# Altium project Reader-Rev6.PrjPcb
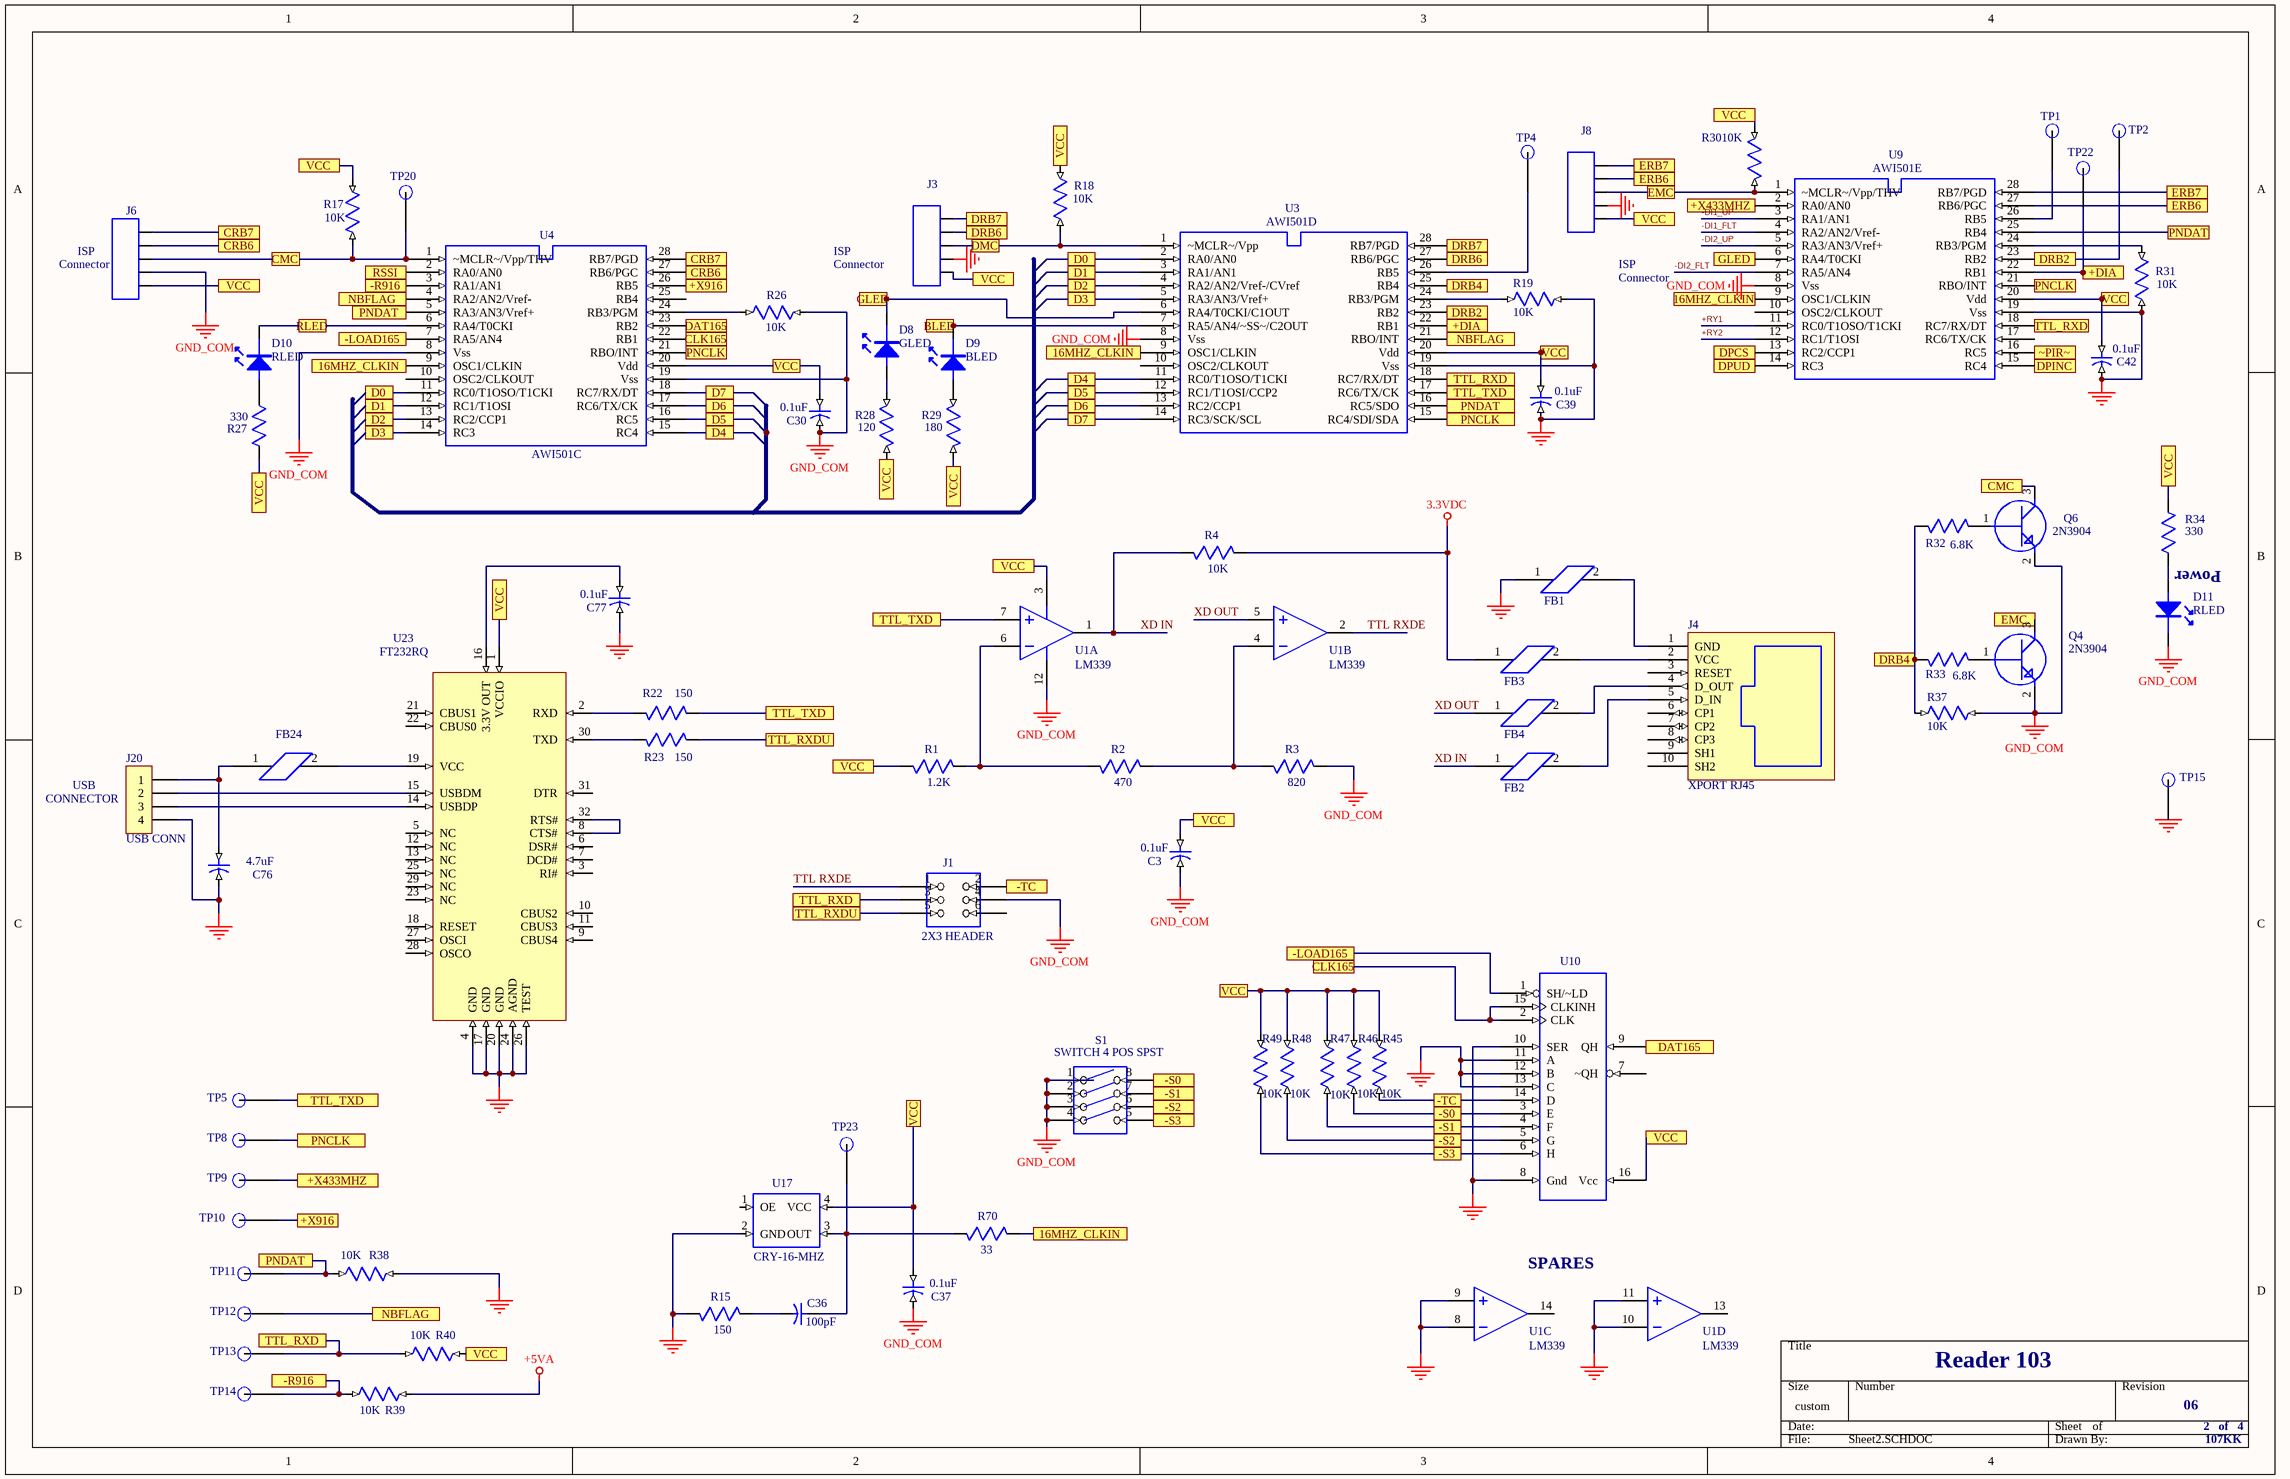
[diagram p0: Sheet2.SCHDOC]
3 sheets, 201 parts. Net scope: global (net labels, ports and power ports of the same name join across sheets).
Sheets:
  Sheet2.SCHDOC
  Sheet3.SCHDOC
  Sheet4.SCHDOC

## Sheet Sheet2.SCHDOC
size 431 x 279 mm; SheetNumber: 0; SheetTotal: 0

### Parts
C3  0.1uF  [0603]
C30  0.1uF  [0603]
C36  100pF  [0603]
C37  0.1uF  [0603]
C39  0.1uF  [0603]
C42  0.1uF  [0603]
C76  4.7uF  [0805]
C77  0.1uF  [0603]
D8  GLED  [LED TH]
D9  BLED  [LED TH]
D10  RLED  [LED TH]
D11  RLED  [LED TH]
FB1  FB  [0603]  (value not drawn)
FB2  FB  [0603]  (value not drawn)
FB3  FB  [0603]  (value not drawn)
FB4  FB  [0603]  (value not drawn)
FB24  FB  [0603]  (value not drawn)
J1  2X3 HEADER  [HDR3X2]
J3  HDR5  [HDR5]  (value not drawn)
J4  XPORT RJ45  [CONN XPORT]
J6  HDR5  [HDR5]  (value not drawn)
J8  1X5 HEADER  [HDR5]  (value not drawn)
J20  USB CONN  [USB JACK]
Q4  2N3904  [SOT-23]
Q6  2N3904  [SOT-23]
R1  1.2K  [0603]
R2  470  [0603]
R3  820  [0603]
R4  10K  [0603]
R15  150  [0603]
R17  10K  [0603]
R18  10K  [0603]
R19  10K  [0603]
R22  150  [0603]
R23  150  [0603]
R26  10K  [0603]
R27  330  [0603]
R28  120  [0603]
R29  180  [0603]
R30  10K  [0603]
R31  10K  [0603]
R32  6.8K  [0603]
R33  6.8K  [0603]
R34  330  [0603]
R37  10K  [0603]
R38  10K  [0603]
R39  10K  [0603]
R40  10K  [0603]
R45  10K  [0603]
R46  10K  [0603]
R47  10K  [0603]
R48  10K  [0603]
R49  10K  [0603]
R70  33  [0603]
S1  SWITCH 4 POS SPST  [SWITCH 4 POS SPST]
TP1  TP  [TEST POINT PAD 3]  (value not drawn)
TP2  TP  [TEST POINT PAD 3]  (value not drawn)
TP4  TP  [TEST POINT PAD 3]  (value not drawn)
TP5  TP  [TEST POINT PAD 3]  (value not drawn)
TP8  TP  [TEST POINT PAD 3]  (value not drawn)
TP9  TP  [TEST POINT PAD 3]  (value not drawn)
TP10  TP  [TEST POINT PAD 3]  (value not drawn)
TP11  TP  [TEST POINT PAD 3]  (value not drawn)
TP12  TP  [TEST POINT PAD 3]  (value not drawn)
TP13  TP  [TEST POINT PAD 3]  (value not drawn)
TP14  TP  [TEST POINT PAD 3]  (value not drawn)
TP15  TP  [TEST POINT PAD 3]  (value not drawn)
TP20  TP  [TEST POINT PAD 3]  (value not drawn)
TP22  TP  [TEST POINT PAD 3]  (value not drawn)
TP23  TP  [TEST POINT PAD 3]  (value not drawn)
U1  LM339  [SO14]  (parts A,B,C,D of 4)
U3  AWI501D  [SSOP-28]
U4  AWI501C  [PIC16F870]
U9  AWI501E  [PIC16F870]
U10  74165  [SO16]  (value not drawn)
U17  CRY-16-MHZ  [CRY-SMD-5-7]
U23  FT232RQ  [QFN32]

### Ports
16MHZ_CLKIN, +DIA, +X433MHZ, +X916, -LOAD165, -R916, -S0, -S1, -S2, -S3, -TC, BLED, CLK165, CMC, CRB6, CRB7, D0, D1, D2, D3, D4, D5, D6, D7, DAT165, DMC, DPCS, DPINC, DPUD, DRB2, DRB4, DRB6, DRB7, EMC, ERB6, ERB7, GLED, NBFLAG, PNCLK, PNDAT, RLED, RSSI, TTL_RXD, TTL_RXDU, TTL_TXD, VCC, ~PIR~

### Nets
3.3VDC: FB3.1 R4.1(A)
+5VA: R39.1(A)
+5VD: C3.1(A) C30.1(A) C37.1(A) C39.1(A) C42.1(A) J3.5 J6.5 J8.5 R1.2(B) R17.1(A) R18.1(A) R27.1(A) R28.1(A) R29.1(A) R30.1(A) R34.2(B) R40.1(A) R45.2(B) R46.2(B) R47.2(B) R48.2(B) R49.2(B) U1.3 U3.20(Vdd) U4.20(Vdd) U9.20(Vdd) U10.16(Vcc) U17.4(VCC) U23.1(VCCIO) ; port VCC
GND_COM: C3.2(B) C30.2(B) C37.2(B) C39.2(B) C42.2(B) C76.2(B) C77.2(B) D11.K FB1.1 J1.4 J3.4 J6.4 J8.4 J20.4 Q4.2 Q6.2 R3.1(A) R15.2(B) R19.1(A) R26.2(B) R31.2(B) R37.2(B) R38.1(A) S1.1 S1.2 S1.3 S1.4 TP15.1(TP) U1.8 U1.9 U1.10 U1.11 U1.12 U3.8(Vss) U3.19(Vss) U4.8(Vss) U4.19(Vss) U9.8(Vss) U9.19(Vss) U10.8(Gnd) U10.10(SER) U10.11(A) U10.12(B) U10.13(C) U17.2(GND) U23.4(GND) U23.17(GND) U23.20(GND) U23.24(AGND) U23.26(TEST)
+RY1: U9.11(RC0/T1OSO/T1CKI)
+RY2: U9.12(RC1/T1OSI)
-DI1_FLT: U9.4(RA2/AN2/Vref-)
-DI1_UP: U9.3(RA1/AN1)
-DI2_FLT: U9.7(RA5/AN4)
-DI2_UP: U9.5(RA3/AN3/Vref+)
SOUT: R39.2(B) TP14.1(TP) U4.3(RA1/AN1) ; port -R916
TTL RXDE: J1.1 U1.2
XD IN: FB2.1 R4.2(B) U1.1
XD OUT: FB4.1 U1.5
NetC36_1: C36.1(A) R70.2(B) TP23.1(TP) U17.3(OUT)
NetC36_2: C36.2(B) R15.1(A)
NetC40_1: U9.13(RC2/CCP1) ; port DPCS
NetC43_1: TP9.1(TP) U9.2(RA0/AN0) ; port +X433MHZ
NetC45_1: TP10.1(TP) U4.26(RB5) ; port +X916
NetC47_1: U4.2(RA0/AN0) ; port RSSI
NetC50_1: U9.14(RC3) ; port DPUD
NetC51_1: U9.15(RC4) ; port DPINC
NetC76_1: C76.1(A) FB24.1 J20.1
NetC77_1: C77.1(A) U23.16(3.3V_OUT)
NetD3_A: U9.16(RC5) ; port ~PIR~
NetD8_A: D8.A R28.2(B)
NetD8_K: D8.K U3.6(RA4/T0CKI/C1OUT) U9.6(RA4/T0CKI) ; port GLED
NetD9_A: D9.A R29.2(B)
NetD9_K: D9.K U3.7(RA5/AN4/~SS~/C2OUT) ; port BLED
NetD10_A: D10.A R27.2(B)
NetD10_K: D10.K U4.6(RA4/T0CKI) ; port RLED
NetD11_A: D11.A R34.1(A)
NetFB1_2: FB1.2 J4.1(GND)
NetFB2_2: FB2.2 J4.5(D_IN)
NetFB3_2: FB3.2 J4.2(VCC)
NetFB4_2: FB4.2 J4.4(D_OUT)
NetFB24_2: FB24.2 U23.19(VCC)
NetJ1_2: J1.2 R45.1(A) U10.14(D) ; port -TC
NetJ1_3: J1.3 R40.2(B) TP13.1(TP) U3.18(RC7/RX/DT) U9.18(RC7/RX/DT) ; port TTL_RXD
NetJ1_5: J1.5 R23.1(A) ; port TTL_RXDU
NetJ3_1: J3.1 U3.28(RB7/PGD) ; port DRB7
NetJ3_2: J3.2 U3.27(RB6/PGC) ; port DRB6
NetJ3_3: J3.3 R18.2(B) U3.1(~MCLR~/Vpp) ; port DMC
NetJ6_1: J6.1 U4.28(RB7/PGD) ; port CRB7
NetJ6_2: J6.2 U4.27(RB6/PGC) ; port CRB6
NetJ6_3: J6.3 Q6.3 R17.2(B) TP20.1(TP) U4.1(~MCLR~/Vpp/THV) ; port CMC
NetJ8_1: J8.1 U9.28(RB7/PGD) ; port ERB7
NetJ8_2: J8.2 U9.27(RB6/PGC) ; port ERB6
NetJ8_3: J8.3 Q4.3 R30.2(B) U9.1(~MCLR~/Vpp/THV) ; port EMC
NetJ19_1: R70.1(A) U3.9(OSC1/CLKIN) U4.9(OSC1/CLKIN) U9.9(OSC1/CLKIN) ; port 16MHZ_CLKIN
NetJ20_2: J20.2 U23.15(USBDM)
NetJ20_3: J20.3 U23.14(USBDP)
NetQ4_1: Q4.1 R33.2(B)
NetQ6_1: Q6.1 R32.2(B)
NetR1_1: R1.1(A) R2.2(B) U1.6
NetR2_1: R2.1(A) R3.2(B) U1.4
NetR19_2: R19.2(B) U3.24(RB3/PGM)
NetR22_1: R22.1(A) TP5.1(TP) U1.7 U3.17(RC6/TX/CK) ; port TTL_TXD
NetR22_2: R22.2(B) U23.2(RXD)
NetR23_2: R23.2(B) U23.30(TXD)
NetR26_1: R26.1(A) U4.24(RB3/PGM)
NetR31_1: R31.1(A) U9.24(RB3/PGM)
NetR32_1: R32.1(A) R33.1(A) R37.1(A) U3.25(RB4) ; port DRB4
NetR38_2: R38.2(B) TP11.1(TP) U3.16(RC5/SDO) U4.5(RA3/AN3/Vref+) U9.25(RB4) ; port PNDAT
NetR46_1: R46.1(A) S1.8 U10.3(E) ; port -S0
NetR47_1: R47.1(A) S1.7 U10.4(F) ; port -S1
NetR48_1: R48.1(A) S1.6 U10.5(G) ; port -S2
NetR49_1: R49.1(A) S1.5 U10.6(H) ; port -S3
NetTP1_1: TP1.1(TP) U9.26(RB5)
NetTP2_1: TP2.1(TP) U3.23(RB2) U9.23(RB2) ; port DRB2
NetTP4_1: TP4.1(TP) U3.26(RB5)
NetTP8_1: TP8.1(TP) U3.15(RC4/SDI/SDA) U4.21(RBO/INT) U9.21(RBO/INT) ; port PNCLK
NetTP12_1: TP12.1(TP) U3.21(RBO/INT) U4.4(RA2/AN2/Vref-) ; port NBFLAG
NetTP22_1: TP22.1(TP) U3.22(RB1) U9.22(RB1) ; port +DIA
NetU3_2: U3.2(RA0/AN0) U4.11(RC0/T1OSO/T1CKI) ; port D0
NetU3_3: U3.3(RA1/AN1) U4.12(RC1/T1OSI) ; port D1
NetU3_4: U3.4(RA2/AN2/Vref-/CVref) U4.13(RC2/CCP1) ; port D2
NetU3_5: U3.5(RA3/AN3/Vref+) U4.14(RC3) ; port D3
NetU3_11: U3.11(RC0/T1OSO/T1CKI) U4.15(RC4) ; port D4
NetU3_12: U3.12(RC1/T1OSI/CCP2) U4.16(RC5) ; port D5
NetU3_13: U3.13(RC2/CCP1) U4.17(RC6/TX/CK) ; port D6
NetU3_14: U3.14(RC3/SCK/SCL) U4.18(RC7/RX/DT) ; port D7
NetU4_7: U4.7(RA5/AN4) U10.1(SH/~LD) ; port -LOAD165
NetU4_22: U4.22(RB1) U10.2(CLK) U10.15(CLKINH) ; port CLK165
NetU4_23: U4.23(RB2) U10.9(QH) ; port DAT165
NetU23_8: U23.8(CTS#) U23.32(RTS#)

Not connected (* = marked no-connect by the designer): J1 6; J4 3(RESET) 6(CP1) 7(CP2) 8(CP3) 9(SH1) 10(SH2); U1 13 14; U3 10(OSC2/CLKOUT); U4 10(OSC2/CLKOUT) 25(RB4); U9 10(OSC2/CLKOUT) 17(RC6/TX/CK); U10 7(~QH); U17 1(OE); U23 3(RI#) 5(NC) 6(DSR#) 7(DCD#) 9(CBUS4) 10(CBUS2) 11(CBUS3) 12(NC) 13(NC) 18(RESET) 21(CBUS1) 22(CBUS0) 23(NC) 25(NC) 27(OSCI) 28(OSCO) 29(NC) 31(DTR)

### Notes on the sheet
- (near J6) Connector
- (near J6) ISP
- ISP
- Connector
- Power
- (near J20) CONNECTOR
- USB
- (near U1) SPARES
- Reader 103
- 06
- 2   of   4
- 107KK

### Library data of the parts
C3 C30 C37 C39 C42 C76 C77 = C_603: Part Field 1: Part Number ECJ-1VF1H104Z; Part Field 2: Vendor Panasonic - ECG; Part Field 3: Description CAP .1UF 50V CERAMIC Y5V 0603
C36 = C_0603: Part Field 1: Part Number ECJ-1VC1H101J; Part Field 2: Vendor Panasonic - ECG; Part Field 3: Description CAP CERAMIC 100PF 50V 0603 SMD
D8-D11 = LED
FB1-FB4 FB24 = FB_0603: Part Field 1: Part Number EXC-ML16A270U; Part Field 2: Vendor Panasonic - ECG; Part Field 3: Description BEAD CORE 27 OHM 4A 0603 SMD
J1 = HDR3X2: Part Field 1: Part Number PTC03DAAN
J4 = XPORT
J8 = HDR5
J20 = CON4: Connector
Q4 Q6 = XSTR_NPN_SOT23: Part Field 1: Part Number FMMT3904TA; Part Field 2: Vendor Zetex Inc.; Part Field 3: Description TRANS GP NPN 40V 200MA SOT-23
R1-R4 R15 R22 R23 R70 = R_0603: Part Field 1: Part Number 9C06031A1500JLHFT; Part Field 2: Vendor Yageo America; Part Field 3: Description RES 150 OHM 1/16W 5% 0603 SMD
R17-R19 R26 R30 R31 R37-R40 = R_603: Part Field 1: Part Number ERA-V15J103V; Part Field 2: Vendor Panasonic - ECG; Part Field 3: Description RES 10K OHM 1/16W 1500PPM 5%0603
R27 = R_0603: Part Field 1: Part Number ERJ-3GEYJ331V; Part Field 2: Vendor Panasonic - ECG; Part Field 3: Description RES 330 OHM 1/10W 5% 0603 SMD
R28 = R0402: Part Field 1: Part Number ERJ-3GEYJ121V; Part Field 2: Vendor Panasonic - ECG; Part Field 3: Description RES 120 OHM 1/10W 5% 0603 SMD
R29 = R0402: Part Field 1: Part Number ERJ-3GEYJ181V; Part Field 2: Vendor Panasonic - ECG; Part Field 3: Description RES 180 OHM 1/10W 5% 0603 SMD
R32-R34 = R_0603: Part Field 1: Part Number ERJ-3GEYJ682V; Part Field 2: Vendor Panasonic - ECG; Part Field 3: Description RES 6.8K OHM 1/10W 5% 0603 SMD
R45-R49 = R_603: Part Field 1: Part Number ERJ-3GEYJ121V; Part Field 2: Vendor Panasonic - ECG; Part Field 3: Description RES 120 OHM 1/10W 5% 0603 SMD
S1 = SW_4PIN_SMT
TP1 TP2 TP4 TP5 TP8-TP15 TP20 TP22 TP23 = TESTPOINT_1
U1 = OPAMP: Operational Amplifier
U3 = PIC16F876A: Part Field 1: Part Number PIC16F876A-E/SO; Part Field 2: Vendor Microchip Technology; Part Field 3: Description IC MCU FLASH 8KX14 W/AD 28-SOIC
U4 U9 = PIC16F870: Part Field 1: Part Number PIC16F870-E/SO; Part Field 2: Vendor Microchip Technology; Part Field 3: Description IC MCU CMOS 20MHZ 2K FLSH 28SOIC
U10 = 74165-SO-16
U17 = CRY-SMD-5-7
U23 = USB FT232RQ

## Sheet Sheet3.SCHDOC
size 431 x 279 mm; SheetNumber: 0; SheetTotal: 0
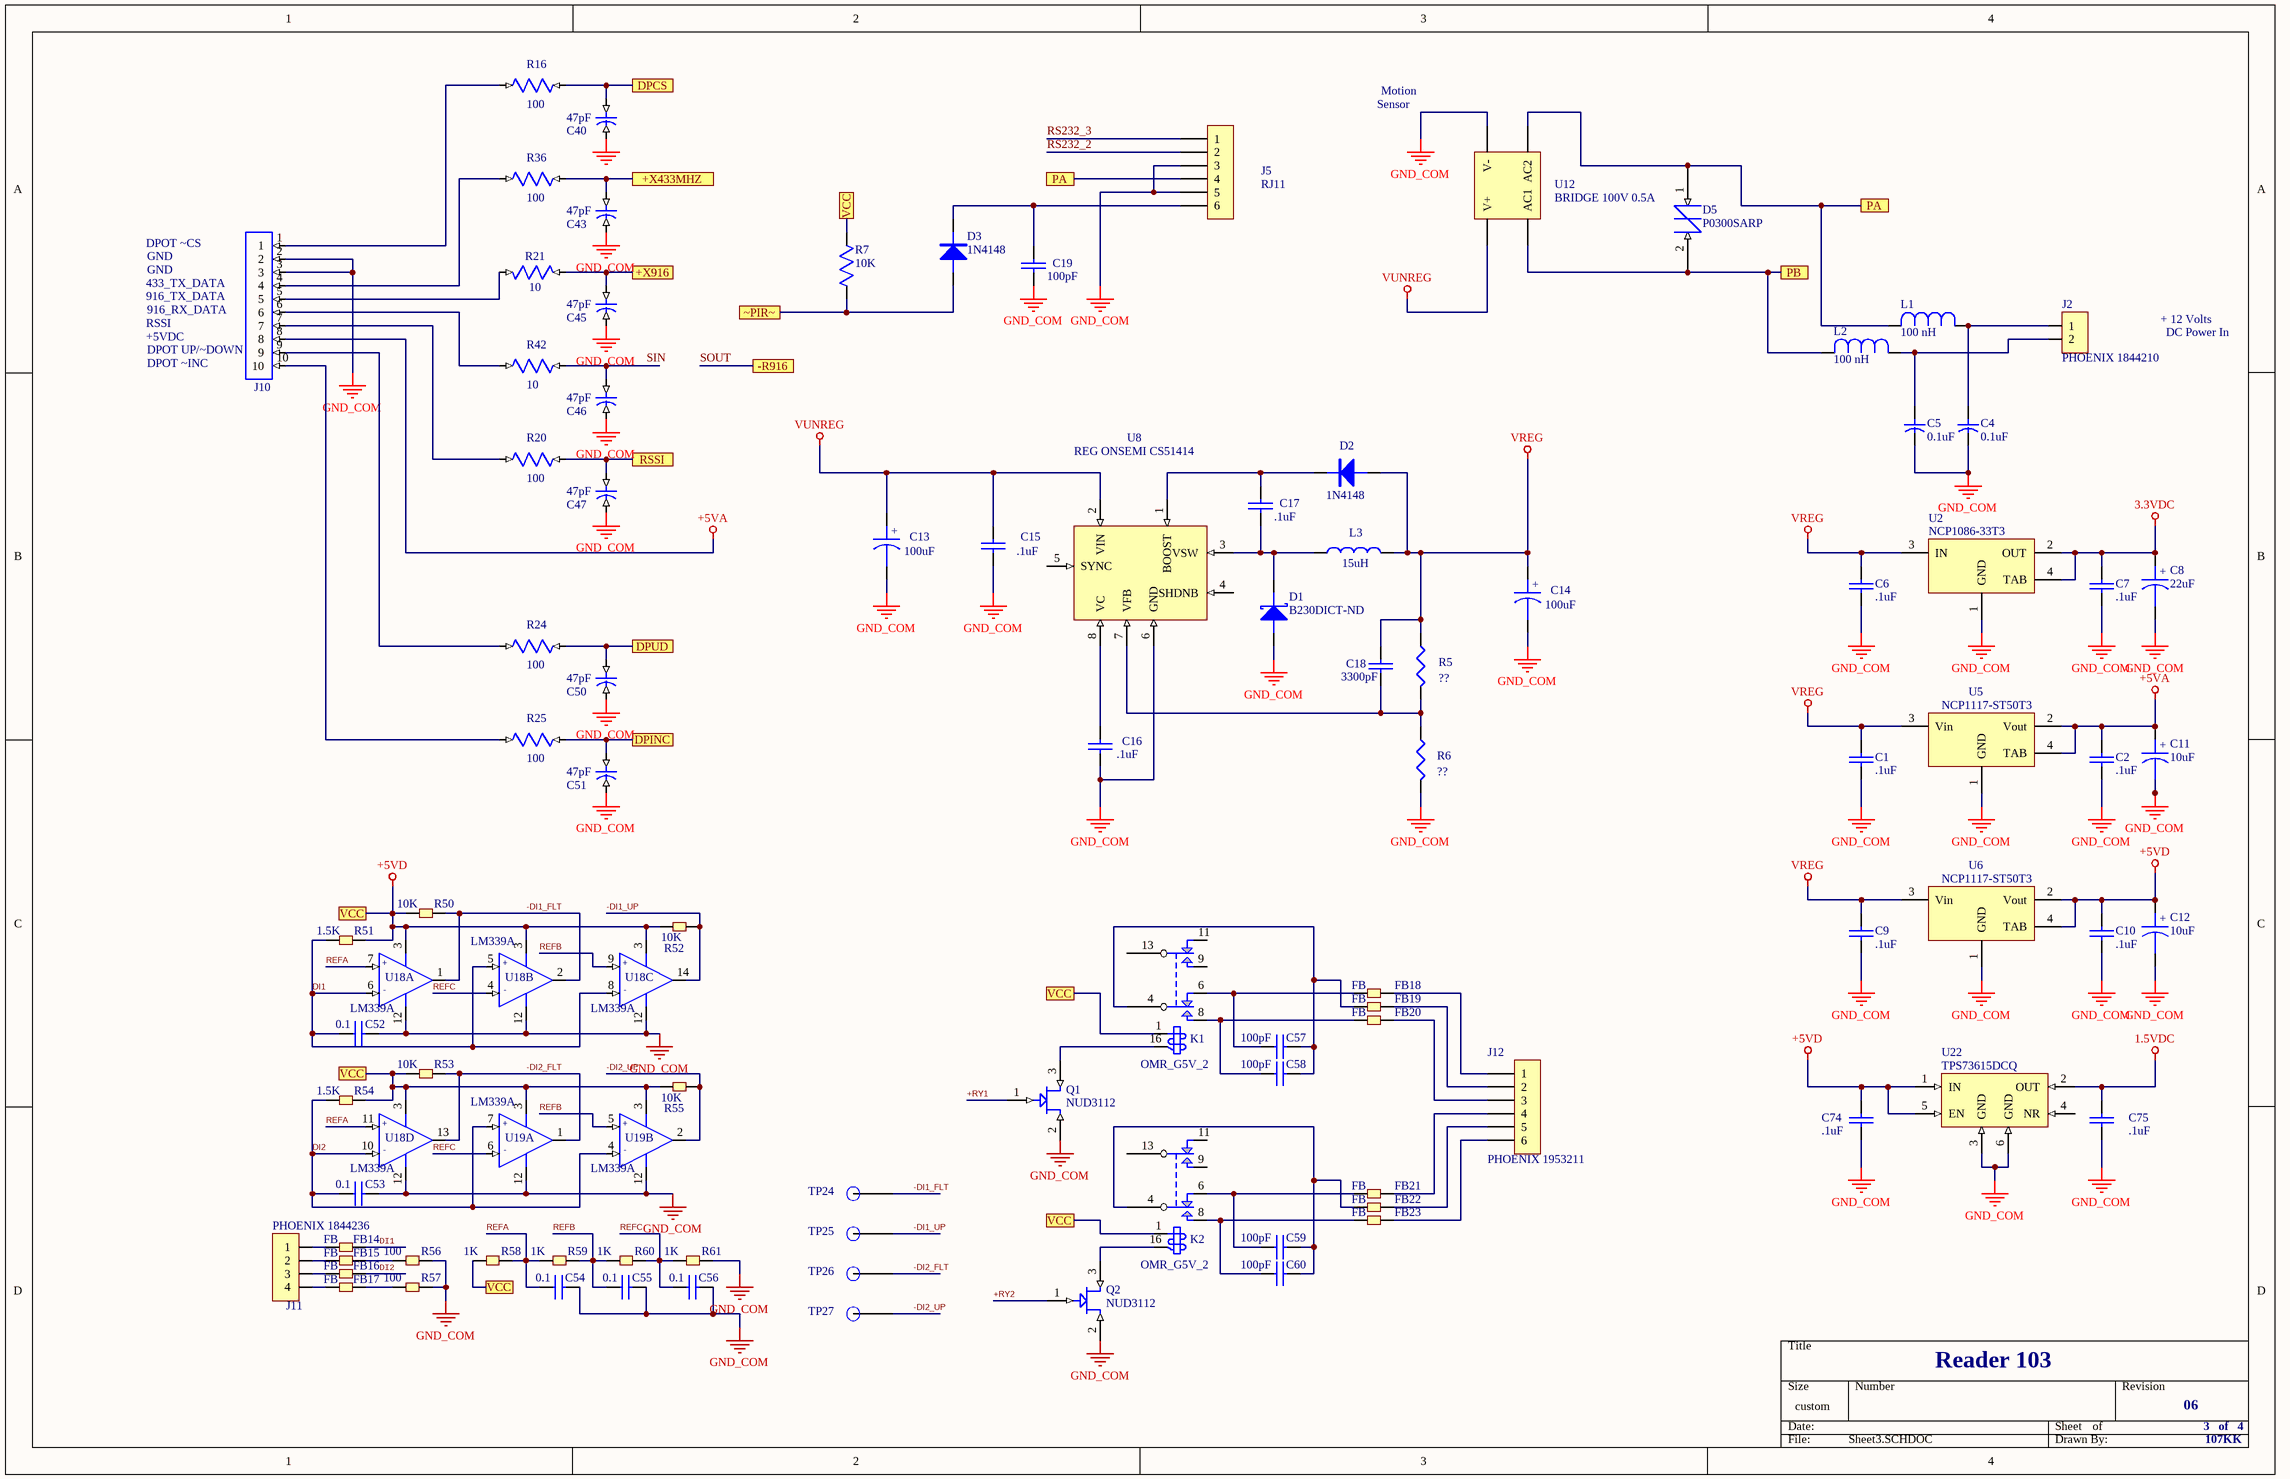
[diagram p1: Sheet3.SCHDOC]

### Parts
C1  .1uF  [0603]
C2  .1uF  [0603]
C4  0.1uF  [0603]
C5  0.1uF  [0603]
C6  .1uF  [0603]
C7  .1uF  [0603]
C8  22uF  [CAP A CASE]
C9  .1uF  [0603]
C10  .1uF  [0603]
C11  10uF  [CAP A CASE]
C12  10uF  [CAP A CASE]
C13  100uF  [CAP D CASE]
C14  100uF  [CAP D CASE]
C15  .1uF  [0603]
C16  .1uF  [0603]
C17  .1uF  [0603]
C18  3300pF  [0603]
C19  100pF  [0603]
C40  47pF  [0603]
C43  47pF  [0603]
C45  47pF  [0603]
C46  47pF  [0603]
C47  47pF  [0603]
C50  47pF  [0603]
C51  47pF  [0603]
C52  0.1  [0603]
C53  0.1  [0603]
C54  0.1  [0603]
C55  0.1  [0603]
C56  0.1  [0603]
C57  100pF  [0603]
C58  100pF  [0603]
C59  100pF  [0603]
C60  100pF  [0603]
C74  .1uF  [0603]
C75  .1uF  [0603]
D1  B230DICT-ND  [DIODE SMB]
D2  1N4148  [SOD123]
D3  1N4148  [SOD123]
D5  P0300SARP  [TRANSORB_1]
FB14  FB  [0603]
FB15  FB  [0603]
FB16  FB  [0603]
FB17  FB  [0603]
FB18  FB  [0603]
FB19  FB  [0603]
FB20  FB  [0603]
FB21  FB  [0603]
FB22  FB  [0603]
FB23  FB  [0603]
J2  PHOENIX 1844210  [CONN PHOENIX 1844210-2]
J5  RJ11  [RJ11]
J10  1X10 HEADER  [HDR_10]  (value not drawn)
J11  PHOENIX 1844236  [CONN PHOENIX 1844236-4]
J12  PHOENIX 1953211  [CONN PHOENIX 1953211-6]
K1  OMR_G5V_2  [RELAY44]
K2  OMR_G5V_2  [RELAY44]
L1  100 nH  [0603]
L2  100 nH  [0603]
L3  15uH  [COIL COILTRONICS UP2B-150]
Q1  NUD3112  [SOT23]
Q2  NUD3112  [SOT23]
R5  ??  [0603]
R6  ??  [0603]
R7  10K  [0603]
R16  100  [0603]
R20  100  [0603]
R21  10  [0603]
R24  100  [0603]
R25  100  [0603]
R36  100  [0603]
R42  10  [0603]
R50  10K  [0603]
R51  1.5K  [0603]
R52  10K  [0603]
R53  10K  [0603]
R54  1.5K  [0603]
R55  10K  [0603]
R56  100  [0603]
R57  100  [0603]
R58  1K  [0603]
R59  1K  [0603]
R60  1K  [0603]
R61  1K  [0603]
TP24  TP  [TEST POINT PAD 3]  (value not drawn)
TP25  TP  [TEST POINT PAD 3]  (value not drawn)
TP26  TP  [TEST POINT PAD 3]  (value not drawn)
TP27  TP  [TEST POINT PAD 3]  (value not drawn)
U2  NCP1086-33T3  [SOT223 REG]
U5  NCP1117-ST50T3  [SOT223 REG]
U6  NCP1117-ST50T3  [SOT223 REG]
U8  REG ONSEMI CS51414  [SO8]
U12  BRIDGE 100V 0.5A  [BRIDGE]
U18  LM339A  [SO14]  (parts A,B,C,D of 4)
U19  LM339A  [SO14]  (parts A,B of 4)
U22  TPS73615DCQ  [SOT223-5]

### Ports
+X433MHZ, +X916, -R916, DPCS, DPINC, DPUD, PA, PB, RSSI, VCC, ~PIR~

### Nets
1.5VDC: C75.1 U22.2(OUT)
3.3VDC: C7.1 C8.1 U2.2(OUT) U2.4(TAB)
+5VA: C2.1 C11.1 J10.8 U5.2(Vout) U5.4(TAB)
+5VD: C10.1 C12.1 C74.1 K1.1(COIL1) K2.1(COIL1) R7.1(A) R50.2 R51.1 R52.2 R53.2 R54.1 R55.2 R58.2 U6.2(Vout) U6.4(TAB) U18.3(V+) U19.3(V+) U22.1(IN) U22.5(EN) ; port VCC
GND_COM: C1.2 C2.2 C4.2(B) C5.2(B) C6.2 C7.2 C8.2 C9.2 C10.2 C11.2 C12.2 C13.2 C14.2 C15.2 C16.2 C19.2 C40.2(B) C43.2(B) C45.2(B) C46.2(B) C47.2(B) C50.2(B) C51.2(B) C52.2 C53.2 C54.2 C55.2 C56.2 C74.2 C75.2 D1.A J5.3 J5.5 J10.2 J10.3 Q1.2(S) Q2.2(S) R6.2 R56.1 R57.1 R61.1 U2.1(GND) U5.1(GND) U6.1(GND) U8.6(GND) U12.V- U18.12(V-) U19.12(V-) U22.3(GND) U22.6(GND)
VREG: C1.1 C6.1 C9.1 C14.1 C18.1 D2.A L3.2 R5.1 U2.3(IN) U5.3(Vin) U6.3(Vin)
VUNREG: C13.1 C15.1 U8.2(VIN) U12.V+
+RY1: Q1.1(G)
+RY2: Q2.1(G)
-DI1_FLT: R50.1 TP24.1(TP) U18.1(OUT) U18.2(OUT)
-DI1_UP: R52.1 TP25.1(TP) U18.14(OUT)
-DI2_FLT: R53.1 TP26.1(TP) U18.13(OUT) U19.1(OUT)
-DI2_UP: R55.1 TP27.1(TP) U19.2(OUT)
DI1: C52.1 FB14.1 R51.2 U18.5(+) U18.6(-) U18.8(-)
DI2: C53.1 FB16.1 R54.2 U18.10(-) U19.4(-) U19.7(+)
REFA: C54.1 R58.1 R59.2 U18.7(+) U18.11(+)
REFB: C55.1 R59.1 R60.2 U18.9(+) U19.5(+)
REFC: C56.1 R60.1 R61.2 U18.4(-) U19.6(-)
RS232_2: J5.2
RS232_3: J5.1
SIN: C46.1(A) R42.2(B)
NetC4_1: C4.1(A) J2.1 L1.2(A)
NetC5_1: C5.1(A) J2.2 L2.2(A)
NetC16_1: C16.1 U8.8(VC)
NetC17_1: C17.1 D2.K U8.1(BOOST)
NetC17_2: C17.2 D1.K L3.1 U8.3(VSW)
NetC18_2: C18.2 R5.2 R6.1 U8.7(VFB)
NetC19_1: C19.1 D3.K J5.6
NetC40_1: C40.1(A) R16.2(B) ; port DPCS
NetC43_1: C43.1(A) R36.2(B) ; port +X433MHZ
NetC45_1: C45.1(A) R21.1(A) ; port +X916
NetC47_1: C47.1(A) R20.2(B) ; port RSSI
NetC50_1: C50.1(A) R24.2(B) ; port DPUD
NetC51_1: C51.1(A) R25.2(B) ; port DPINC
NetC57_1: C57.1 FB18.2 K1.6(NC2)
NetC57_2: C57.2 C58.2 FB19.2 K1.4(COMMON2)
NetC58_1: C58.1 FB20.2 K1.8(NO2)
NetC59_1: C59.1 FB21.2 K2.6(NC2)
NetC59_2: C59.2 C60.2 FB22.2 K2.4(COMMON2)
NetC60_1: C60.1 FB23.2 K2.8(NO2)
NetD3_A: D3.A R7.2(B) ; port ~PIR~
NetD5_1: D5.1 J5.4 L1.1(B) U12.AC2 ; port PA
NetD5_2: D5.2 L2.1(B) U12.AC1 ; port PB
NetFB14_2: FB14.2 J11.1
NetFB15_1: FB15.1 R56.2
NetFB15_2: FB15.2 J11.2
NetFB16_2: FB16.2 J11.3
NetFB17_1: FB17.1 R57.2
NetFB17_2: FB17.2 J11.4
NetFB18_1: FB18.1 J12.1
NetFB19_1: FB19.1 J12.2
NetFB20_1: FB20.1 J12.3
NetFB21_1: FB21.1 J12.4
NetFB22_1: FB22.1 J12.5
NetFB23_1: FB23.1 J12.6
NetJ10_1: J10.1 R16.1(A)
NetJ10_4: J10.4 R36.1(A)
NetJ10_5: J10.5 R21.2(B)
NetJ10_6: J10.6 R42.1(A)
NetJ10_7: J10.7 R20.1(A)
NetJ10_9: J10.9 R24.1(A)
NetJ10_10: J10.10 R25.1(A)
NetK1_16: K1.16(COIL2) Q1.3(D)
NetK2_16: K2.16(COIL2) Q2.3(D)

Not connected (* = marked no-connect by the designer): K1 9(NO1) 11(NC1) 13(COMMON1); K2 9(NO1) 11(NC1) 13(COMMON1); U8 4(SHDNB) 5(SYNC); U22 4(NR)

### Notes on the sheet
- Motion
- Sensor
- DPOT ~CS
- 916_TX_DATA
- 433_TX_DATA
- GND
- +5VDC
- RSSI
- DPOT ~INC
- (near J10) DPOT UP/~DOWN
- 916_RX_DATA
- + 12 Volts
- DC Power In
- Reader 103
- 06
- 3   of   4
- 107KK
- (in symbol CAPACITOR POL) +

### Library data of the parts
C1 C2 C6 C7 C9 C10 C15-C19 C74 C75 = CAP: Capacitor
C4 C5 = C_0603: Part Field 1: Description CAP .10UF 25V CERAMIC Y5V 0603; Part Field 2: Vendor Kemet; Part Field 3: Part Number C0603C104Z3VACTU
C8 C11-C14 = CAPACITOR POL: Capacitor
C40 C43 C45-C47 C50 C51 = C0603: Part Field 1: Part Number 0603N470J500NT; Part Field 2: Vendor BC Components; Part Field 3: Description Cap, Ceramic, 47pF, 50V, NP0, 0603, SMD
C52-C60 = CAP NP_1: Text Field1: 20; Text Field2: 10
D1 = DIODE SCHOTTKY: Schottky Diode
D2 D3 = DIODE
D5 = TRANSORB
FB14-FB23 = FB: Text Field1: 10; Text Field2: 20
J2 = CON2: Connector
J5 J12 = CON6: Connector
J10 = HDR10
J11 = CON4: Text Field1: 20; Text Field2: 50
K1 K2 = OMRON_G5V_3: Text Field1: 20; Text Field2: 100
L1 L2 = INDUCTOR_1: Part Field 1: Part Number ELJ-RER10JF3; Part Field 2: Vendor Panasonic - ECG; Part Field 3: Description INDUCTOR 100NH 5% FIXED SMD
L3 = INDUCTOR1
Q1 Q2 = INDUCTIVE LOAD DRIVER
R5 R6 = RES1
R7 = R_0603: Part Field 1: Part Number ERA-V15J103V; Part Field 2: Vendor Panasonic - ECG; Part Field 3: Description RES 10K OHM 1/16W 1500PPM 5%0603
R16 R20 R24 R25 R36 R42 = R0603: Part Field 1: Part Number 9C06031A1000JLHFT; Part Field 2: Vendor Yageo America; Part Field 3: Description RES, 100 OHM, 1/10W, 5%, 0603, SMD
R21 = R_603: Part Field 1: Part Number 9C06031A10R0FKHFT; Part Field 2: Vendor Yageo America; Part Field 3: Description RES, 10, OHM, 1/16W, 5%, 0603, SMD
R50-R61 = RS: Text Field1: 10; Text Field2: 20
TP24-TP27 = TESTPOINT_1
U2 = REG GOI
U5 U6 = REG REVERSED
U12 = BRIDGE2: Diode Bridge
U18 U19 = LM339: Text Field1: 40; Text Field2: 40
U22 = REG SOT223-5

## Sheet Sheet4.SCHDOC
size B; SheetNumber: 0; SheetTotal: 0
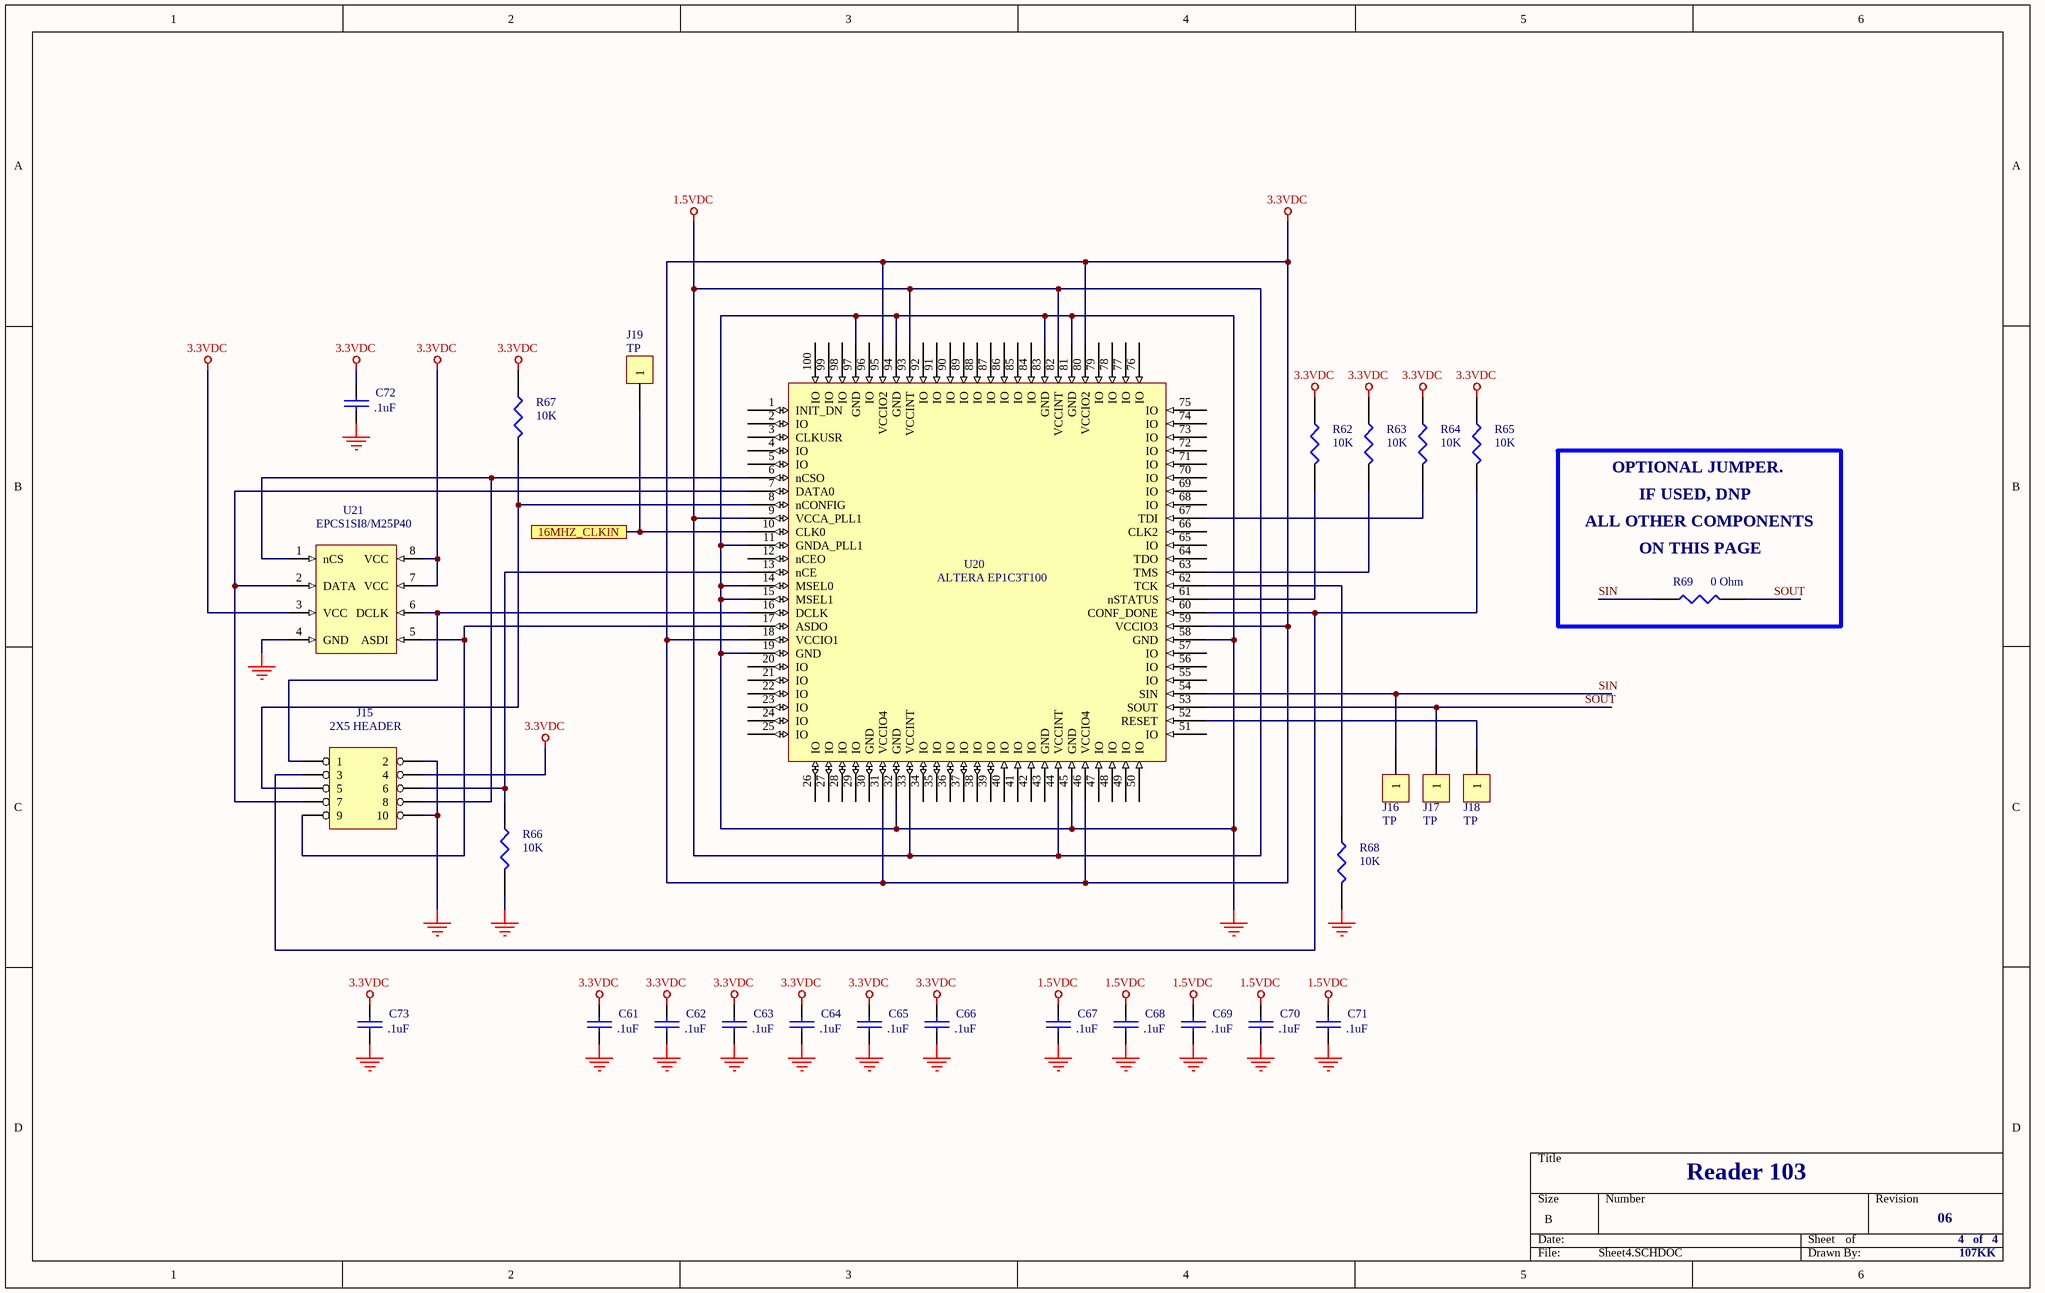
[diagram p2: Sheet4.SCHDOC]

### Parts
C61  .1uF  [0603]
C62  .1uF  [0603]
C63  .1uF  [0603]
C64  .1uF  [0603]
C65  .1uF  [0603]
C66  .1uF  [0603]
C67  .1uF  [0603]
C68  .1uF  [0603]
C69  .1uF  [0603]
C70  .1uF  [0603]
C71  .1uF  [0603]
C72  .1uF  [0603]
C73  .1uF  [0603]
J15  2X5 HEADER  [2X5 HEADER]
J16  TP  [TEST POINT PAD 3]
J17  TP  [TEST POINT PAD 3]
J18  TP  [TEST POINT PAD 3]
J19  TP  [TEST POINT PAD 3]
R62  10K  [0603]
R63  10K  [0603]
R64  10K  [0603]
R65  10K  [0603]
R66  10K  [0603]
R67  10K  [0603]
R68  10K  [0603]
R69  0 Ohm  [0603]
U20  ALTERA EP1C3T100  [TQFP100]
U21  EPCS1SI8/M25P40  [SO8]

### Ports
16MHZ_CLKIN

### Nets
1.5VDC: C67.1 C68.1 C69.1 C70.1 C71.1 U20.9(VCCA_PLL1) U20.33(VCCINT) U20.44(VCCINT) U20.82(VCCINT) U20.93(VCCINT)
3.3VDC: C61.1 C62.1 C63.1 C64.1 C65.1 C66.1 C72.1 C73.1 J15.4 R62.1 R63.1 R64.1 R65.1 R67.1 U20.18(VCCIO1) U20.31(VCCIO4) U20.46(VCCIO4) U20.59(VCCIO3) U20.80(VCCIO2) U20.95(VCCIO2) U21.3(VCC) U21.7(VCC) U21.8(VCC)
GND_COM: C61.2 C62.2 C63.2 C64.2 C65.2 C66.2 C67.2 C68.2 C69.2 C70.2 C71.2 C72.2 C73.2 J15.2 J15.10 R66.2 R68.2 U20.11(GNDA_PLL1) U20.14(MSEL0) U20.15(MSEL1) U20.19(GND) U20.32(GND) U20.45(GND) U20.58(GND) U20.81(GND) U20.83(GND) U20.94(GND) U20.97(GND) U21.4(GND)
SIN: J16.1 R69.1 U20.54(SIN)
SOUT: J17.1 R69.2 U20.53(SOUT)
NetJ15_1: J15.1 U20.16(DCLK) U21.6(DCLK)
NetJ15_3: J15.3 R65.2 U20.60(CONF_DONE)
NetJ15_5: J15.5 R67.2 U20.8(nCONFIG)
NetJ15_6: J15.6 R66.1 U20.13(nCE)
NetJ15_7: J15.7 U20.7(DATA0) U21.2(DATA)
NetJ15_8: J15.8 U20.6(nCSO) U21.1(nCS)
NetJ15_9: J15.9 U20.17(ASDO) U21.5(ASDI)
NetJ18_1: J18.1 U20.52(RESET)
NetJ19_1: J19.1 U20.10(CLK0) ; port 16MHZ_CLKIN
NetR62_2: R62.2 U20.61(nSTATUS)
NetR63_2: R63.2 U20.63(TMS)
NetR64_2: R64.2 U20.67(TDI)
NetR68_1: R68.1 U20.62(TCK)

Not connected (* = marked no-connect by the designer): U20 1(INIT_DN) 2(IO) 3(CLKUSR) 4(IO) 5(IO) 12(nCEO) 20(IO) 21(IO) 22(IO) 23(IO) 24(IO) 25(IO) 26(IO) 27(IO) 28(IO) 29(IO) 30(GND) 34(IO) 35(IO) 36(IO) 37(IO) 38(IO) 39(IO) 40(IO) 41(IO) 42(IO) 43(GND) 47(IO) 48(IO) 49(IO) 50(IO) 51(IO) 55(IO) 56(IO) 57(IO) 64(TDO) 65(IO) 66(CLK2) 68(IO) 69(IO) 70(IO) 71(IO) 72(IO) 73(IO) 74(IO) 75(IO) 76(IO) 77(IO) 78(IO) 79(IO) 84(IO) 85(IO) 86(IO) 87(IO) 88(IO) 89(IO) 90(IO) 91(IO) 92(IO) 96(IO) 98(IO) 99(IO) 100(IO)

### Notes on the sheet
- OPTIONAL JUMPER.
- IF USED, DNP
- ALL OTHER COMPONENTS
- (near R69) ON THIS PAGE
- Reader 103
- 06
- 4   of   4
- 107KK

### Library data of the parts
C61-C73 = CAP: Capacitor
J15 = HEADER 5X2
J16-J19 = CON1: Connector
R62-R69 = RES1

## Nets that join several sheets
1.5VDC: Sheet3 (C75.1 U22.2), Sheet4 (10 pins)
3.3VDC: Sheet2 (FB3.1 R4.1), Sheet3 (C7.1 C8.1 U2.2 U2.4), Sheet4 (23 pins)
+5VA: Sheet2 (R39.1), Sheet3 (5 pins)
+5VD: Sheet2 (29 pins), Sheet3 (19 pins)
GND_COM: Sheet2 (50 pins), Sheet3 (50 pins), Sheet4 (29 pins)
+RY1: Sheet2 (U9.11), Sheet3 (Q1.1)
+RY2: Sheet2 (U9.12), Sheet3 (Q2.1)
-DI1_FLT: Sheet2 (U9.4), Sheet3 (R50.1 TP24.1 U18.1 U18.2)
-DI1_UP: Sheet2 (U9.3), Sheet3 (R52.1 TP25.1 U18.14)
-DI2_FLT: Sheet2 (U9.7), Sheet3 (R53.1 TP26.1 U18.13 U19.1)
-DI2_UP: Sheet2 (U9.5), Sheet3 (R55.1 TP27.1 U19.2)
NetC40_1: Sheet2 (U9.13), Sheet3 (C40.1 R16.2)
NetC43_1: Sheet2 (TP9.1 U9.2), Sheet3 (C43.1 R36.2)
NetC45_1: Sheet2 (TP10.1 U4.26), Sheet3 (C45.1 R21.1)
NetC47_1: Sheet2 (U4.2), Sheet3 (C47.1 R20.2)
NetC50_1: Sheet2 (U9.14), Sheet3 (C50.1 R24.2)
NetC51_1: Sheet2 (U9.15), Sheet3 (C51.1 R25.2)
NetD3_A: Sheet2 (U9.16), Sheet3 (D3.A R7.2)
NetJ19_1: Sheet2 (R70.1 U3.9 U4.9 U9.9), Sheet4 (J19.1 U20.10)
SIN: Sheet3 (C46.1 R42.2), Sheet4 (J16.1 R69.1 U20.54)
SOUT: Sheet2 (R39.2 TP14.1 U4.3), Sheet4 (J17.1 R69.2 U20.53)